# EAGLE design esp32-hanover-flipdot (EAGLE 9.6.1)
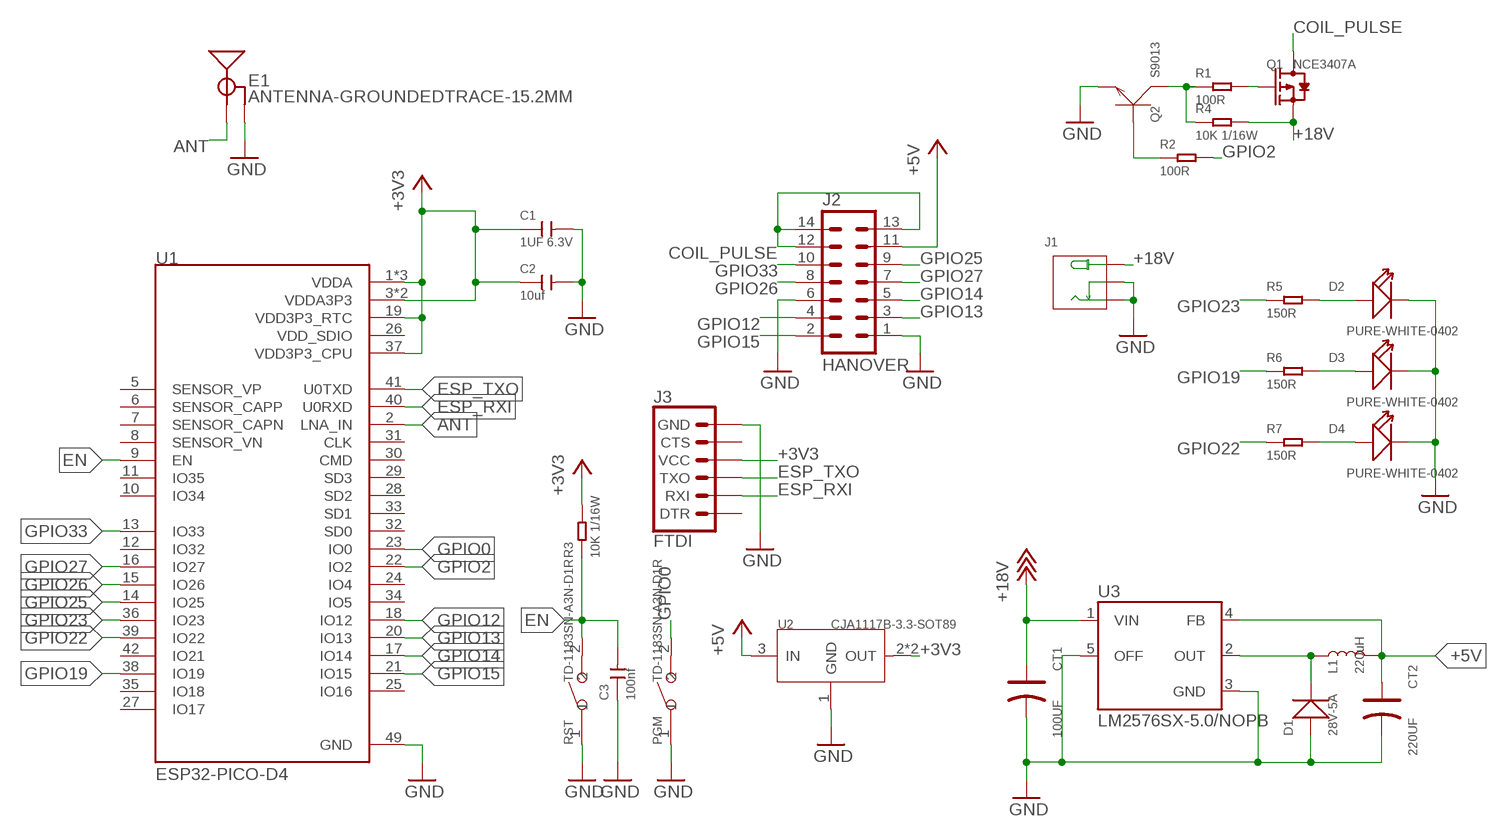
[diagram p0: schematic, sheet 1]

## Parts
C1  1UF 6.3V  CERAMIC-1UF-6.3V-10%-X5R(0402)  [C0402]
C2  10uf  CERAMIC-10UF-6.3V-20%-X5R(0402)  [C0402]
C3  100nf  CERAMIC-100NF-25V-10%-X7R(0402)  [C0402]
CT1  100UF  ALUMINUM-SMD-220UF-16V(D6.3-H7.7MM)  [ELECTRO-SMD-C-6MM]
CT2  220UF  ALUMINUM-SMD-220UF-16V(D6.3-H7.7MM)  [ELECTRO-SMD-C-6MM]
D1  28V-5A  SMD-DIODE-SCHOTTKY-28V-5A(DO-214AA)  [DO-214AA]
D2  PURE-WHITE-0402  SMD-LED-YELLOW-DIFFUSED-PURE-WHITE(0402)  [LED-0402]
D3  PURE-WHITE-0402  SMD-LED-YELLOW-DIFFUSED-PURE-WHITE(0402)  [LED-0402]
D4  PURE-WHITE-0402  SMD-LED-YELLOW-DIFFUSED-PURE-WHITE(0402)  [LED-0402]
E1  ANTENNA-GROUNDEDTRACE-15.2MM  [TRACE_ANTENNA_2.4GHZ_15.2MM]
J1  DC-005  JACK-DC-005'DC-005'  [3P-L14.2*W11.0*H9.0MM]
J2  HANOVER  ML14  [ML14]
J3  FTDI  6_PIN_SERIAL_TARGETSILK  [6_PIN_SERIAL_TARGET_SIDE_W_SILK]
L1  220uH  INDUCTOR-CR54-3.3UH  [CR54]
PGM  TD-1183SN-A3N-D1R  SMD-BUTTON(2P-3.0X2.5X1.2+0.4MM)-B3U-1000P-2P-SMD  [SW2-2.6-3.0X2.5X1.2+0.4MM]
Q1  NCE3407A  SMD-MOSFET-P-CH-VDC=30V-ID=4.3A-NCE3407A(SOT-23)  [SOT-23]
Q2  S9013  SMD-TRANSISTORS-NPN-25V-500MA-S9013(SOT-23)  [SOT-23]
R1  100R  SMD-RES-100R-5%-1/16W(0402)  [R0402]
R2  100R  SMD-RES-100R-5%-1/16W(0402)  [R0402]
R3  10K 1/16W  SMD-RES-10K-1%-1/16W(0402)  [R0402]
R4  10K 1/16W  SMD-RES-10K-1%-1/16W(0402)  [R0402]
R5  150R  SMD-RES-150R-1%-1/16W(0402)  [R0402]
R6  150R  SMD-RES-150R-1%-1/16W(0402)  [R0402]
R7  150R  SMD-RES-150R-1%-1/16W(0402)  [R0402]
RST  TD-1183SN-A3N-D1R  SMD-BUTTON(2P-3.0X2.5X1.2+0.4MM)-B3U-1000P-2P-SMD  [SW2-2.6-3.0X2.5X1.2+0.4MM]
U1  ESP32-PICO-D4  [PQFN50P700X700X104-49N]
U2  CJA1117B-3.3-SOT89  PMIC-CJA1117B-3.3(SOT-89)  [SOT-89]
U3  LM2576SX-5.0/NOPB  LM2576S  [TO263-5]

## Nets
+3V3: C1.1 C2.1 J3.P$4(VCC) R3.2 U1.1(VDDA) U1.3(VDDA3P3) U1.4(VDDA3P3) U1.19(VDD3P3_RTC) U1.37(VDD3P3_CPU) U1.43(VDDA) U1.46(VDDA) U2.2(OUT) U2.4(OUT)
+5V [power]: CT2.+ J2.11 L1.P$2 U2.3(IN) U3.4(FB)
+18V [power]: CT1.+ J1.+B(+) J1.+T(+) Q1.2(S) R4.2 U3.1(VIN)
ANT: E1.ANT(SIGNAL) U1.2(LNA_IN)
COIL_PULSE: J2.12 J2.13 J2.14 Q1.3(D)
EN: C3.2 R3.1 RST.2 U1.9(EN)
ESP_RXI: J3.P$3(RXI) U1.40(U0RXD)
ESP_TXO: J3.P$2(TXO) U1.41(U0TXD)
GND: C1.2 C2.2 C3.1 CT1.- CT2.- D1.+ D2.- D3.- D4.- E1.GND J1.-1B(-) J1.-1T(-) J1.-2B(CDN) J1.-2T(CDN) J2.1 J2.6 J3.P$6(GND) PGM.1 Q2.2(E) RST.1 U1.49(GND) U2.1(GND) U3.3(GND) U3.5(OFF)
GPIO0: PGM.2 U1.23(IO0)
GPIO2: R2.2 U1.22(IO2)
GPIO12: J2.4 U1.18(IO12)
GPIO13: J2.3 U1.20(IO13)
GPIO14: J2.5 U1.17(IO14)
GPIO15: J2.2 U1.21(IO15)
GPIO19: R6.1 U1.38(IO19)
GPIO22: R7.1 U1.39(IO22)
GPIO23: R5.1 U1.36(IO23)
GPIO25: J2.9 U1.14(IO25)
GPIO26: J2.8 U1.15(IO26)
GPIO27: J2.7 U1.16(IO27)
GPIO33: J2.10 U1.13(IO33)
N$1: Q1.1(G) R1.2
N$2: Q2.3(C) R1.1 R4.1
N$3: Q2.1(B) R2.1
N$4: D1.- L1.P$1 U3.2(OUT)
N$5: D2.+ R5.2
N$6: D3.+ R6.2
N$7: D4.+ R7.2
Unconnected: J3.P$1(DTR) J3.P$5(CTS) U1.5(SENSOR_VP) U1.6(SENSOR_CAPP) U1.7(SENSOR_CAPN) U1.8(SENSOR_VN) U1.10(IO34) U1.11(IO35) U1.12(IO32) U1.24(IO4) U1.25(IO16) U1.27(IO17) U1.28(SD2) U1.29(SD3) U1.30(CMD) U1.31(CLK) U1.32(SD0) U1.33(SD1) U1.34(IO5) U1.35(IO18) U1.42(IO21)

## Power pins joined to a net without a drawn wire
VDD_SDIO: U1.26(VDD_SDIO)

## Library data of the parts
C1 = OPL_Capacitor:CERAMIC-1UF-6.3V-10%-X5R(0402): 302010003; MPN: CC0402KRX5R5BB105
C2 = OPL_Capacitor:CERAMIC-10UF-6.3V-20%-X5R(0402): 302010053; MPN: CC0402MRX5R5BB106
C3 = OPL_Capacitor:CERAMIC-100NF-25V-10%-X7R(0402): 302010024; MPN: CC0402KRX7R8BB104
CT1 = OPL_Capacitor:ALUMINUM-SMD-220UF-16V(D6.3-H7.7MM): 302030053; MPN: 302030000; VALUE: 220UF
CT2 = OPL_Capacitor:ALUMINUM-SMD-220UF-16V(D6.3-H7.7MM): 302030053; MPN: CS1E221M-CRE77
D1 = OPL_Discrete_Semiconductor:SMD-DIODE-SCHOTTKY-28V-5A(DO-214AA): 304020021; MPN: SS54B
D2-D4 = OPL_Optoelectronics:SMD-LED-YELLOW-DIFFUSED-PURE-WHITE(0402): 304090016; MPN: 16-219A/T2D-AR2T1QY/3T
E1 = SparkFun-RF:ANTENNA-GROUNDED: Antenna w/ Ground Connection 2.4GHz antennae with signal and ground terminals. TRACE_ANTENNA_2.4GHZ_15.2MM - Meander Trace antenna 15.2 x 5.7mm footprint Based on layout from TI app note AN043 <http://www.ti.com/lit/an/swra117d/swra117d.pdf>. TRACE_ANTENNA_2.4GHZ_25.7MM - Inverted F trace antenna 25.7 x 7.5 mm footprint. Based on layout from TI design note DN0007 <http://www.ti.com/lit/an/swru120b/swru120b.pdf>.
J1 = OPL_Connector_DC-005_No_Polarity_Markings:JACK-DC-005: Seeed SKU 320120003 - DIP Black DC Jack 2.1MM MPN: DC-005 Important Notes: This part requires milling slots. Please make sure layer 46 Milling is included in the profile or outline layer when exporting Gerber files. Alternatively, you can use the built-in Seeed Fusion CAM file. Find it under Third-Party CAM files. Seeed Fusion PCBA OPL <https://www.seeedstudio.com/opl.html> Order PCB/PCBA Now <https://www.seeedstudio.com/fusion_pcb.html> www.seeedstudio.com
J2 = con-harting-ml:ML14: HARTING; OC_FARNELL: unknown; OC_NEWARK: unknown
J3 = SparkFun-Connectors:6_PIN_SERIAL_TARGET: 6-pin header connection for use with the "FTDI BASIC" pinout - TARGET SIDE. Also known as "Arduino Serial Program Header". It is used to mate with our FTDI Basic serial programmers using the Arduino IDE. Note, this device has "TARGET" in the name. It is intended to be used on a design that contains a target micro-controller that you wish to program. The "sister" device, named "CABLE" is inteneded to be used on a design that usually lives on the end of your USB cable and prvides the converter chip (FTDI232 or FTDI231x) to commnicate serial RX/TX. You can populate with some of these: Break Away Headers - Straight <https://www.sparkfun.com/products/116> (PRT-00116) For reference (or to suit your programming needs) check out these designs: SparkFun FTDI Basic Breakout - 5V <https://www.sparkfun.com/products/9716> (DEV-09716) SparkFun FTDI Basic Breakout - 3.3V <https://www.sparkfun.com/products/9873> (DEV-09873) SparkFun FTDI SmartBasic <https://www.sparkfun.com/products/12935> (DEV-12935) SparkFun Beefy 3 - FTDI Basic Breakout <https://www.sparkfun.com/products/13746> (DEV-13746)
L1 = SparkFun-Coils:INDUCTOR: Inductors Resist changes in electrical current. Basically a coil of wire. SparkFun Products: SparkFun Load Cell Amplifier - HX711 <https://www.sparkfun.com/products/13879> IOIO-OTG - V2.2 <https://www.sparkfun.com/products/13613>; PROD_ID: NDUC-11157; VALUE: 3.3µH/±30%/3.4A
PGM RST = OPL_Switch:SMD-BUTTON(2P-3.0X2.5X1.2+0.4MM): 311020047; MPN: B3U-1000P-2P-SMD; VALUE: B3U-1000P-2P-SMD
Q1 = OPL_Discrete_Semiconductor:SMD-MOSFET-P-CH-VDC=30V-ID=4.3A-NCE3407A(SOT-23): 305030010; MPN: NCE3407A
Q2 = OPL_Discrete_Semiconductor:SMD-TRANSISTORS-NPN-25V-500MA-S9013(SOT-23): 305010018; MPN: S9013
R1 R2 = OPL_Resistor:SMD-RES-100R-5%-1/16W(0402): 301012008; MPN: RC0402JR-07100RL
R3 R4 = OPL_Resistor:SMD-RES-10K-1%-1/16W(0402): 301010047; MPN: RC0402FR-0710KL
R5-R7 = OPL_Resistor:SMD-RES-150R-1%-1/16W(0402): 301011984; MPN: RC0402FR-07150RL; VALUE: 0R
U1 = ESP32-PICO-D4:ESP32-PICO-D4: The ESP32-PICO-D4 is a System-in-Package (SIP) module that is based on ESP32, providing complete Wi-Fi and Bluetooth functionalities. The module has a size as small as 7.0±0.1 mm×7.0±0.1 mm×0.94±0.1 mm, thus requiring minimal PCB area. The module integrates a 4-MB SPI flash; DESCRIPTION: WIFi/Bluetooth SIP; MF: Espressif Systems; MP: ESP32-PICO-D4; PACKAGE: SMD-48 Espressif Systems
U2 = OPL_IC:PMIC-CJA1117B-3.3(SOT-89): 310030095; MPN: CJA1117B-3.3
U3 = LM2576 (1):LM2576: National Semiconductor <http://www.national.com> 3.0A "Simple Switcher"(c) 52kHz, Vout 1.23-37V (HV: 57V), Vin 40V (HV: 60V), 50µA standby current; AVAILABILITY: Unavailable; DESCRIPTION: Integrated Circuit; MF: National Semiconductor; MP: LM2576; PACKAGE: TO-263-6 National Semiconductor; PRICE: None

## Net classes
0 default: width 0.152 mm, drill 0.305 mm
1 power: width 0.305 mm, drill 0.305 mm

## Board
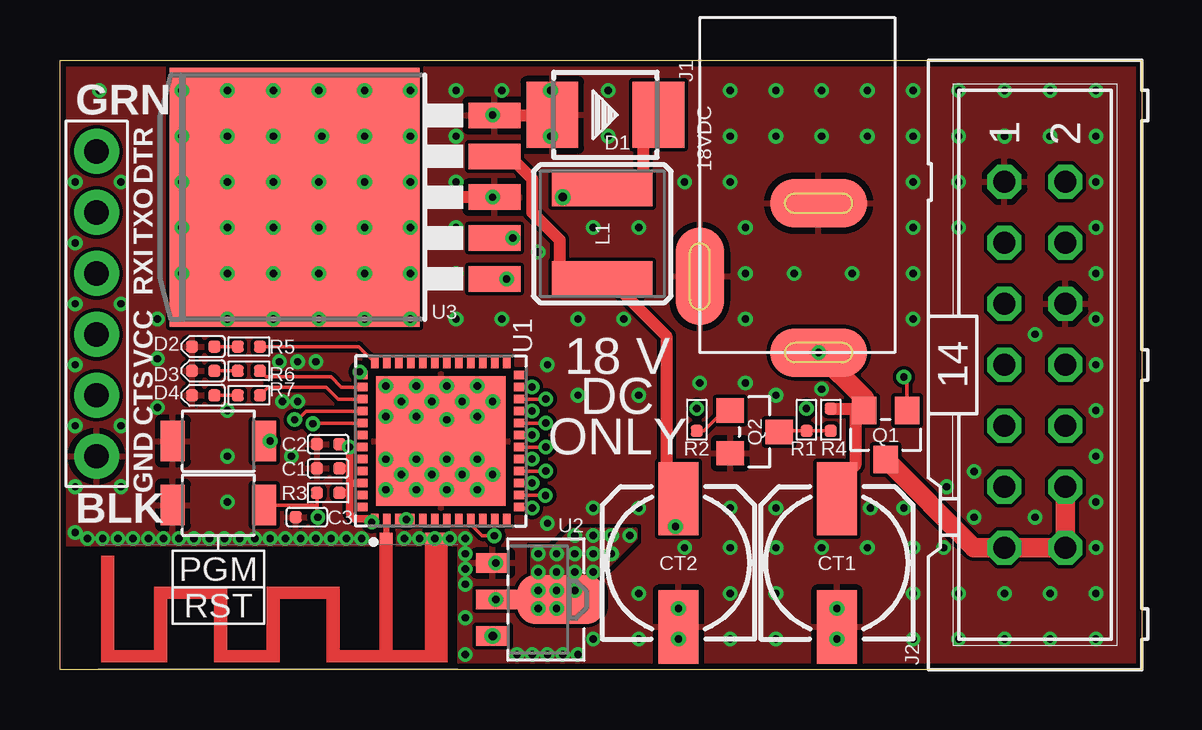
[diagram p1: board, top side]
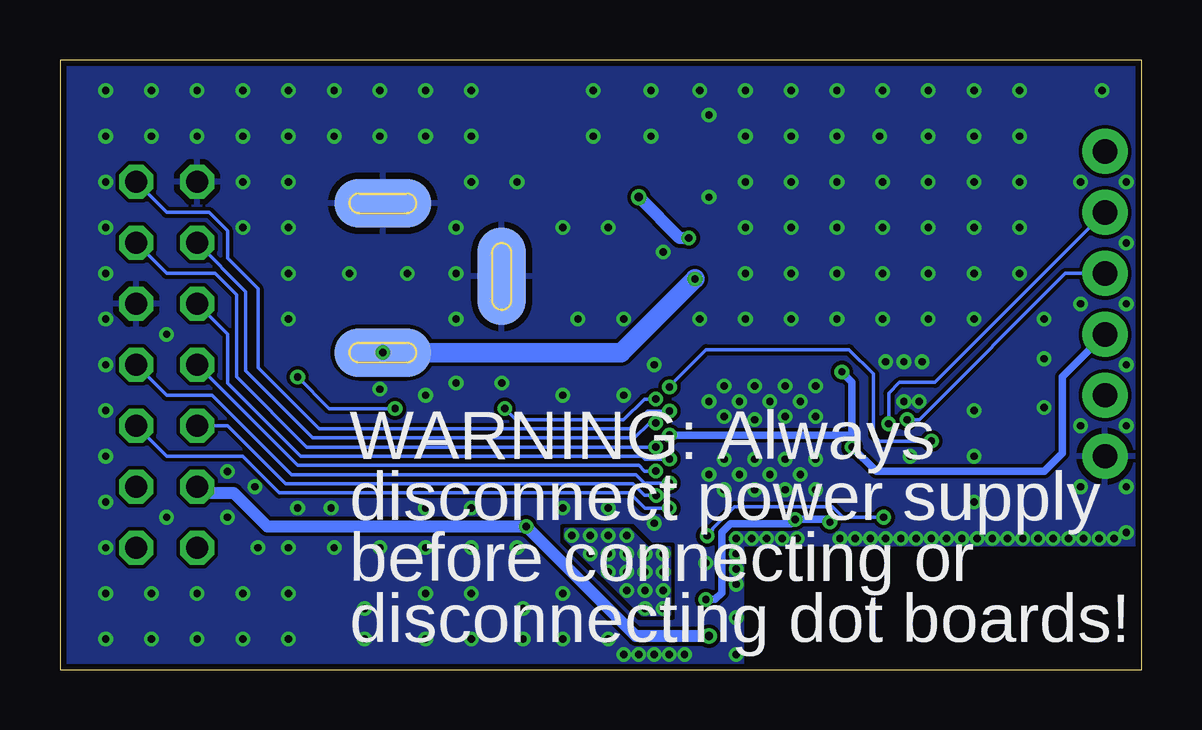
[diagram p2: board, bottom side, seen from below]

Size 45.09 x 25.4 mm. Coordinates in mm from the lower left corner, seen from the top.
Outline: 0,0 0,25.4 45.09,25.4 45.09,0 0,0
Copper layers (1*16): Top 0.035mm / dielectric 1.5mm / Bottom 0.035mm
Design rules "SeeedStudio_2layer_DRU_no_angle_20140221": minimum track width 6mil, minimum drill 12mil, track to track 6mil, track to pad 6mil, pad to pad 6mil, via to via 6mil, smd to smd 0mil, copper to edge 10mil, drill to drill 10mil, minimum pad ring 10mil, minimum via ring 6mil, stop-mask expansion 2mil, vias tented up to drill 100mil, thermal gap 10mil

### Footprints (pad centres in the part's own frame; a part is rotated, then mirrored left to right if it is on the bottom)
C0402 = smd 0.5 x 0.5: 1 0,0.463; 2 0,-0.463
ELECTRO-SMD-C-6MM = smd 3.048 x 1.651: + 2.667,0; - -2.667,0
DO-214AA = smd 2.159 x 2.743: + -2.21,0; - 2.21,0
LED-0402 = smd 0.5 x 0.5: + -0.463,0; - 0.463,0
TRACE_ANTENNA_2.4GHZ_15.2MM = smd 0.5 x 0.5: ANT 0,-0.25 | smd 0.9 x 0.5: GND -2.1,-0.25
3P-L14.2*W11.0*H9.0MM = smd 2.032 x 4.064 bottom: +B 3.175,0; -1B -3.048,0 | smd 2.032 x 4.064: +T 3.175,0; -1T -3.048,0 | smd 4.064 x 2.032 bottom: -2B 0,-4.953 | smd 4.064 x 2.032: -2T 0,-4.953
ML14 = drill 0.914 octagon: 1 -7.62,-1.27; 2 -7.62,1.27; 3 -5.08,-1.27; 4 -5.08,1.27; 5 -2.54,-1.27; 6 -2.54,1.27; 7 0,-1.27; 8 0,1.27; 9 2.54,-1.27; 10 2.54,1.27; 11 5.08,-1.27; 12 5.08,1.27; 13 7.62,-1.27; 14 7.62,1.27
6_PIN_SERIAL_TARGET_SIDE_W_SILK = drill 1.016 pad 1.88: P$1 -6.35,0; P$2 -3.81,0; P$3 -1.27,0; P$4 1.27,0; P$5 3.81,0; P$6 6.35,0
CR54 = smd 4.2 x 1.4: P$1 0,1.85; P$2 0,-1.85
SW2-2.6-3.0X2.5X1.2+0.4MM = smd 1 x 1.7: 1 -1.9,0; 2 1.9,0
SOT-23 = smd 1.016 x 1.143: 1 -0.889,-1.016; 2 0.889,-1.016; 3 0,1.016
R0402 = smd 0.5 x 0.5: 1 0,0.463; 2 0,-0.463
PQFN50P700X700X104-49N = smd 0.45 x 0.35: 1 -3.265,2.75; 2 -3.265,2.25; 3 -3.265,1.75; 4 -3.265,1.25; 5 -3.265,0.75; 6 -3.265,0.25; 7 -3.265,-0.25; 8 -3.265,-0.75; 9 -3.265,-1.25; 10 -3.265,-1.75; 11 -3.265,-2.25; 12 -3.265,-2.75; 25 3.265,-2.75; 26 3.265,-2.25; 27 3.265,-1.75; 28 3.265,-1.25; 29 3.265,-0.75; 30 3.265,-0.25; 31 3.265,0.25; 32 3.265,0.75; 33 3.265,1.25; 34 3.265,1.75; 35 3.265,2.25; 36 3.265,2.75 | smd 0.35 x 0.45: 13 -2.75,-3.265; 14 -2.25,-3.265; 15 -1.75,-3.265; 16 -1.25,-3.265; 17 -0.75,-3.265; 18 -0.25,-3.265; 19 0.25,-3.265; 20 0.75,-3.265; 21 1.25,-3.265; 22 1.75,-3.265; 23 2.25,-3.265; 24 2.75,-3.265; 37 2.75,3.265; 38 2.25,3.265; 39 1.75,3.265; 40 1.25,3.265; 41 0.75,3.265; 42 0.25,3.265; 43 -0.25,3.265; 44 -0.75,3.265; 45 -1.25,3.265; 46 -1.75,3.265; 47 -2.25,3.265; 48 -2.75,3.265 | smd 5.4 x 5.4: 49 0,0
SOT-89 = smd 0.8 x 1.4: 1 -1.524,-1.905; 3 1.524,-1.905 | smd 0.8 x 1.9: 2 0,-1.651 | smd 2.032 x 3.65: 4 0,0.94
TO263-5 = smd 1.067 x 2.159: 1 -3.404,-5.791; 2 -1.702,-5.791; 3 0,-5.791; 4 1.702,-5.791; 5 3.404,-5.791 | smd 10.8 x 10.41: 6 0,2.54

### Placement (x,y rotation side)
C1  11.18,8.38 270 top
C2  11.18,9.4 270 top
C3  10.29,6.35 90 top
CT1  32.38,4.45 90 top
CT2  25.78,4.45 90 top
D1  22.73,23.11 0 top
D2  5.97,13.46 180 top
D3  5.97,12.45 180 top
D4  5.97,11.43 180 top
E1  13.59,5.21 180 top
J1  31.62,16.38 270 top
J2  40.64,12.7 270 top
J3  1.52,15.24 270 top
L1  22.61,18.16 0 top
PGM  6.6,9.53 0 top
Q1  34.42,9.78 180 top
Q2  28.96,9.91 270 top
R1  31.11,10.41 180 top
R2  26.54,10.41 180 top
R3  11.18,7.37 90 top
R4  32.13,10.41 180 top
R5  7.87,13.46 270 top
R6  7.87,12.45 270 top
R7  7.87,11.43 270 top
RST  6.6,6.86 0 top
U1  15.88,9.53 90 top
U2  19.94,2.92 270 top
U3  12.32,19.68 90 top

### Tracks (layer width: path | path; a pad name or v marks a point on that pad's centre or on a via)
+3V3  (via drill 0.3)
  Top 0.305: v19.68,9.78 U1.19 | U2.4 U2.2 v18.16,2.92 | U1.43 v12.07,9.28 v12.06,9.27 | U1.1 13.09,6.29 12.99,6.29 | 12.99,6.29 12.27,6.29 12.07,6.49 12.07,7.37 | U1.46 12.59,7.75 12.07,7.75 | 12.99,6.29 v12.99,6.14 | U1.37 12.49,12.39 v12.49,12.41 | v12.06,9.27 v12.07,9.27 12.07,8.38 | 12.07,8.38 12.07,7.75 | 12.07,7.75 12.07,7.37 | 12.07,7.37 R3.2 | C2.1 11.94,9.4 v12.06,9.27 | 12.07,8.38 C1.1 | U1.4 v14.44,6.26 U1.3
  Bottom 0.305: v12.99,6.14 13.11,6.26 v14.44,6.26 14.63,6.07 17.14,6.07 17.5,5.71 17.5,3.2 17.78,2.92 v18.16,2.92 | v12.49,12.41 12.06,11.98 12.06,9.78 | 12.06,9.78 v12.06,9.27 11.05,8.26 4.06,8.26 3.3,9.02 3.3,12.19 J3.P$4 | v19.68,9.78 12.07,9.78 12.06,9.78
  other vias: 19.94,4.83 19.94,3.3 20.7,4.83 21.46,4.83 22.23,4.83 22.23,5.59 21.46,5.59 22.23,4.06 21.46,4.06 20.7,4.06 19.94,4.06 20.7,3.3 21.46,3.3 19.94,2.54 20.7,2.54 22.99,5.59 23.75,5.59 22.99,4.83
  pour Top (isolate 0.152, no thermals): 19.68,3.05 19.68,5.08 20.57,5.08 21.34,5.84 24,5.84 24.01,5.45 21.59,3.05
  pour Bottom (isolate 0.152, no thermals): 19.68,2.29 19.68,5.08 20.57,5.08 21.34,5.84 24,5.84 24,5.46 20.83,2.29
+5V  (via drill 0.3, 0.35)
  Top 0.305: CT2.+ 25.78,6.99 | 25.78,6.1 v25.65,5.97 | U3.4 18.75,21.39
  Top 0.508: 25.78,6.1 25.78,6.99 25.27,7.49 25.27,13.9 22.86,16.31 L1.P$2 20.83,16.31 20.83,17.91 19.68,19.05 19.68,20.45 18.75,21.39
  Bottom 0.508: J2.11 39.12,7.37 37.85,7.37 36.45,5.97 v25.65,5.97 21.08,1.4 U2.3
  other vias: 18.03,1.4
+18V  (via drill 0.3)
  Top 0.305: CT1.+ 32.38,8
  Top 0.508: 32.64,8 33.15,8.51 33.15,10.79 Q1.2 33.53,10.88 R4.2
  Top 0.61: 32.38,8 32.64,8
  Top 0.813: 33.53,10.88 33.53,11.3 J1.+T | U3.1 v18.62,16.28
  Bottom 0.813: v18.62,16.28 21.69,13.21 J1.+T
  other vias: 31.62,13.21
ANT
  Top 0.152: U1.2 13.59,6.26
  Top 0.254: 13.59,6.26 E1.ANT
COIL_PULSE
  Top 0.813: Q1.3 38.1,5.08 J2.13 J2.14 J2.12
EN  (via drill 0.3)
  Top 0.152: U1.9 17.22,6.16 17.22,5.95 17.59,5.58 v18.11,5.58 | RST.2 10.71,6.86 | 10.71,6.86 R3.1 | C3.2 10.71,6.35 10.71,6.86
  Bottom 0.152: v18.11,5.58 17.88,5.81 17.88,5.87 16.96,6.79 12.88,6.79 12.45,6.35 C3.2
  other vias: 10.75,6.35
ESP_RXI  (via drill 0.3)
  Top 0.152: v9.78,10.41 9.91,10.41 10.27,10.78 U1.40
  Bottom 0.152: J3.P$3 3.17,16.51 9.27,10.41 v9.78,10.41
ESP_TXO  (via drill 0.3)
  Top 0.152: U1.41 10.57,10.28 v10.54,10.24
  Bottom 0.152: v10.54,10.24 10.54,11.51 10.09,11.96 8.61,11.96 J3.P$2
GND  (via drill 0.3)
  Top 0.508: U3.5 20.5,23.09 D1.+ | U3.3 16.13,19.68
  other vias: 1.14,5.46 1.78,5.46 2.41,5.46 3.05,5.46 3.68,5.46 4.32,5.46 4.95,5.46 5.59,5.46 6.22,5.46 6.86,5.46 7.49,5.46 8.13,5.46 8.76,5.46 9.4,5.46 10.03,5.46 10.67,5.46 11.94,5.46 12.57,5.46 14.35,5.46 14.99,5.46 15.62,5.46 16.26,5.46 11.3,5.46 16.89,0.64 26.04,20.32 27.94,24.13 39.37,3.17 41.27,1.27 39.37,1.27 0.64,5.71 16.89,3.56 16.89,4.19 16.89,4.83 27.94,22.23 27.94,20.32 29.84,22.23 29.84,24.13 31.75,22.23 31.75,24.13 37.47,24.13 39.37,24.13 39.37,22.23 41.27,24.13 43.18,24.13 43.18,22.23 43.18,20.32 37.47,22.23 37.47,20.32 37.47,18.41 41.27,3.17 37.47,3.17 37.47,1.27 35.56,3.17 29.84,1.27 29.84,3.17 41.27,22.23 35.56,1.27 16.89,5.46 9.14,12.83 10.67,12.83 9.91,12.83 10.92,22.23 12.7,20.32 10.79,20.32 8.89,20.32 1.65,24.13 0.64,20.32 6.99,10.79 16.51,24.13 16.51,14.61 18.41,14.61 2.54,20.32 4.06,14.61 6.99,6.99 6.99,8.89 18.41,24.13 24.13,11.43 28.57,18.41 28.57,16.51 33.02,16.51 35.56,14.61 35.56,16.51 35.56,18.41 35.56,20.32 33.66,24.13 33.66,22.23 35.56,22.23 35.56,24.13 43.18,18.41 43.18,16.51 43.18,14.61 43.18,12.7 43.18,10.79 43.18,8.89 43.18,6.99 43.18,5.08 43.18,3.17 43.18,1.27 27.94,3.17 27.94,1.27 27.94,5.08 29.84,5.08 31.75,5.08 26.04,5.08 25.78,1.27 24.13,1.27 24.13,3.17 18.16,4.45 22.23,1.27 20.32,6.1 24.13,18.41 20.45,24.13 22.86,24.13 22.86,22.23 20.45,22.23 8.89,18.41 10.79,18.41 12.7,18.41 14.61,22.23 16.51,22.23 16.51,20.32 16.51,18.41 16.51,16.51 15.49,8.13 14.86,8.76 16.13,8.76 22.23,6.73 24.13,6.73 27.94,6.73 29.84,6.73 28.57,11.94 26.67,11.94 16.13,10.41 9.65,8.89 22.23,18.41 4.06,12.95 4.06,10.92 30.61,16.51 20.32,12.7 21.59,14.61 21.59,11.43 14.86,10.54 14.22,11.18 15.49,11.18 16.76,11.18 17.4,10.54 18.03,11.18 17.4,11.81 16.13,11.81 14.86,11.81 13.59,8.76 14.22,8.13 16.76,8.13 17.4,8.76 17.4,7.49 16.13,7.49 14.86,7.49 13.59,7.49 18.03,8.13 13.59,11.81 13.59,10.54 16.89,2.16 19.05,0.64 19.68,0.64 20.32,0.64 20.95,0.64 21.59,0.64 40.64,13.97 12.7,16.51 8.89,16.51 6.99,18.41 14.61,18.41 12.7,24.13 14.61,20.32 10.79,16.51 6.99,16.51 6.99,20.32 6.99,24.13 8.89,24.13 10.79,24.13 14.61,24.13 12.7,22.23 14.61,16.51 18.03,19.68 18.03,23.11 19.94,17.4 35.18,6.73 33.66,5.08 35.56,5.08 32.38,1.27 32.38,2.54 25.78,2.54 9.27,11.18 9.91,11.18 29.84,11.43 31.75,11.68 23.5,14.61 28.57,14.61 6.99,22.23 8.89,22.23 12.7,14.61 14.61,14.61 10.79,14.61 8.89,14.61 6.99,14.61 5.08,24.13 5.08,22.23 5.08,20.32 5.08,18.41 5.08,16.51 0.64,17.78 0.64,15.24 2.54,15.24 0.64,12.7 2.54,10.16 0.64,10.16 0.64,7.62 2.54,7.62 40.64,6.35 38.1,6.35 38.1,8.26 36.96,7.62 33.78,6.73 36.83,5.08
  pour Top (rank 6): 0,5.21 16.64,5.21 16.64,0 45.09,0 45.09,25.4 0,25.4
  pour Bottom (rank 6): 0,5.21 16.64,5.21 16.64,0 45.09,0 45.09,25.4 0,25.4
GPIO0  (via drill 0.3)
  Top 0.152: v19.68,11.78 U1.23 | v8.76,9.53 PGM.2
  Bottom 0.152: v19.68,11.78 19.68,11.81 18.16,13.34 12.19,13.34 11.18,12.32 11.18,9.78 10.92,9.53 v8.76,9.53
GPIO2  (via drill 0.3)
  Top 0.152: v20.25,11.28 U1.22
  Bottom 0.152: R2.2 26.08,10.41 21.59,10.41 20.73,11.28 v20.25,11.28
  other vias: 26.54,10.88
GPIO12  (via drill 0.3)
  Top 0.152: v20.25,9.28 U1.18
  Bottom 0.152: J2.4 40.64,16.51 38.61,16.51 37.72,15.62 37.72,12.19 34.8,9.28 v20.25,9.28
GPIO13  (via drill 0.3)
  Top 0.152: v20.25,10.28 U1.20
  Bottom 0.152: J2.3 37.34,15.75 37.34,12.45 34.54,9.65 21.13,9.65 20.51,10.28 v20.25,10.28
GPIO14  (via drill 0.3)
  Top 0.152: v19.68,8.78 U1.17
  Bottom 0.152: J2.5 38.1,13.97 38.1,11.94 35.05,8.89 20.83,8.89 20.7,8.76 19.69,8.76 v19.68,8.78
GPIO15  (via drill 0.3)
  Top 0.152: v19.68,10.78 U1.21
  Bottom 0.152: J2.2 40.64,19.05 38.86,19.05 38.1,18.29 38.1,17.14 36.83,15.88 36.83,12.57 34.29,10.03 21.34,10.03 20.59,10.78 v19.68,10.78
GPIO19
  Top 0.152: R6.1 8.59,12.19 11.3,12.19 11.72,11.78 U1.38
GPIO22
  Top 0.152: R7.1 8.67,11.76 11.1,11.76 11.59,11.28 U1.39
GPIO23
  Top 0.152: R5.1 12.45,13.46 U1.36
GPIO25  (via drill 0.3)
  Top 0.152: U1.14 20.22,7.28 v20.24,7.26
  Bottom 0.152: v20.24,7.26 20.72,7.26 21.21,7.75 35.69,7.75 38.1,10.16 J2.9
GPIO26  (via drill 0.3)
  Top 0.152: v19.68,7.78 U1.15
  Bottom 0.152: J2.8 40.64,11.43 38.73,11.43 35.43,8.13 21.08,8.13 20.73,7.78 v19.68,7.78
GPIO27  (via drill 0.3)
  Top 0.152: v20.25,8.28 U1.16
  Bottom 0.152: J2.7 35.18,8.51 20.95,8.51 20.72,8.28 v20.25,8.28
GPIO33  (via drill 0.3)
  Top 0.152: U1.13 19.18,6.73 v19.68,6.73
  Bottom 0.152: v19.68,6.73 20.7,6.73 21.34,7.37 35.94,7.37 37.47,8.89 40.64,8.89 J2.10
N$1  (via drill 0.3)
  Top 0.152: v35.18,12.19 35.31,12.06 Q1.1
  Bottom 0.152: R1.2 33.86,10.88 v35.18,12.19
  other vias: 31.11,10.88
N$2
  Top 0.152: Q2.3 30.02,9.95 R1.1 R4.1
N$3
  Top 0.152: Q2.1 27.69,10.79 26.84,9.95 R2.1
N$4  (via drill 0.3, 0.35)
  Top 0.508: v20.95,19.68 21.28,20.01 L1.P$1 23.95,20.01 24.31,20.37 24.31,22.48 D1.- | v18.87,17.98 U3.2
  Bottom 0.508: v18.87,17.98 19.25,17.98 v20.95,19.68
N$5
  Top 0.152: R5.2 D2.+
N$6
  Top 0.152: R6.2 D3.+
N$7
  Top 0.152: R7.2 D4.+

### Text on the board
tNames: 18VDC | 18 V / DC / ONLY
bNames: WARNING: Always / disconnect power supply / before connecting or / disconnecting dot boards!